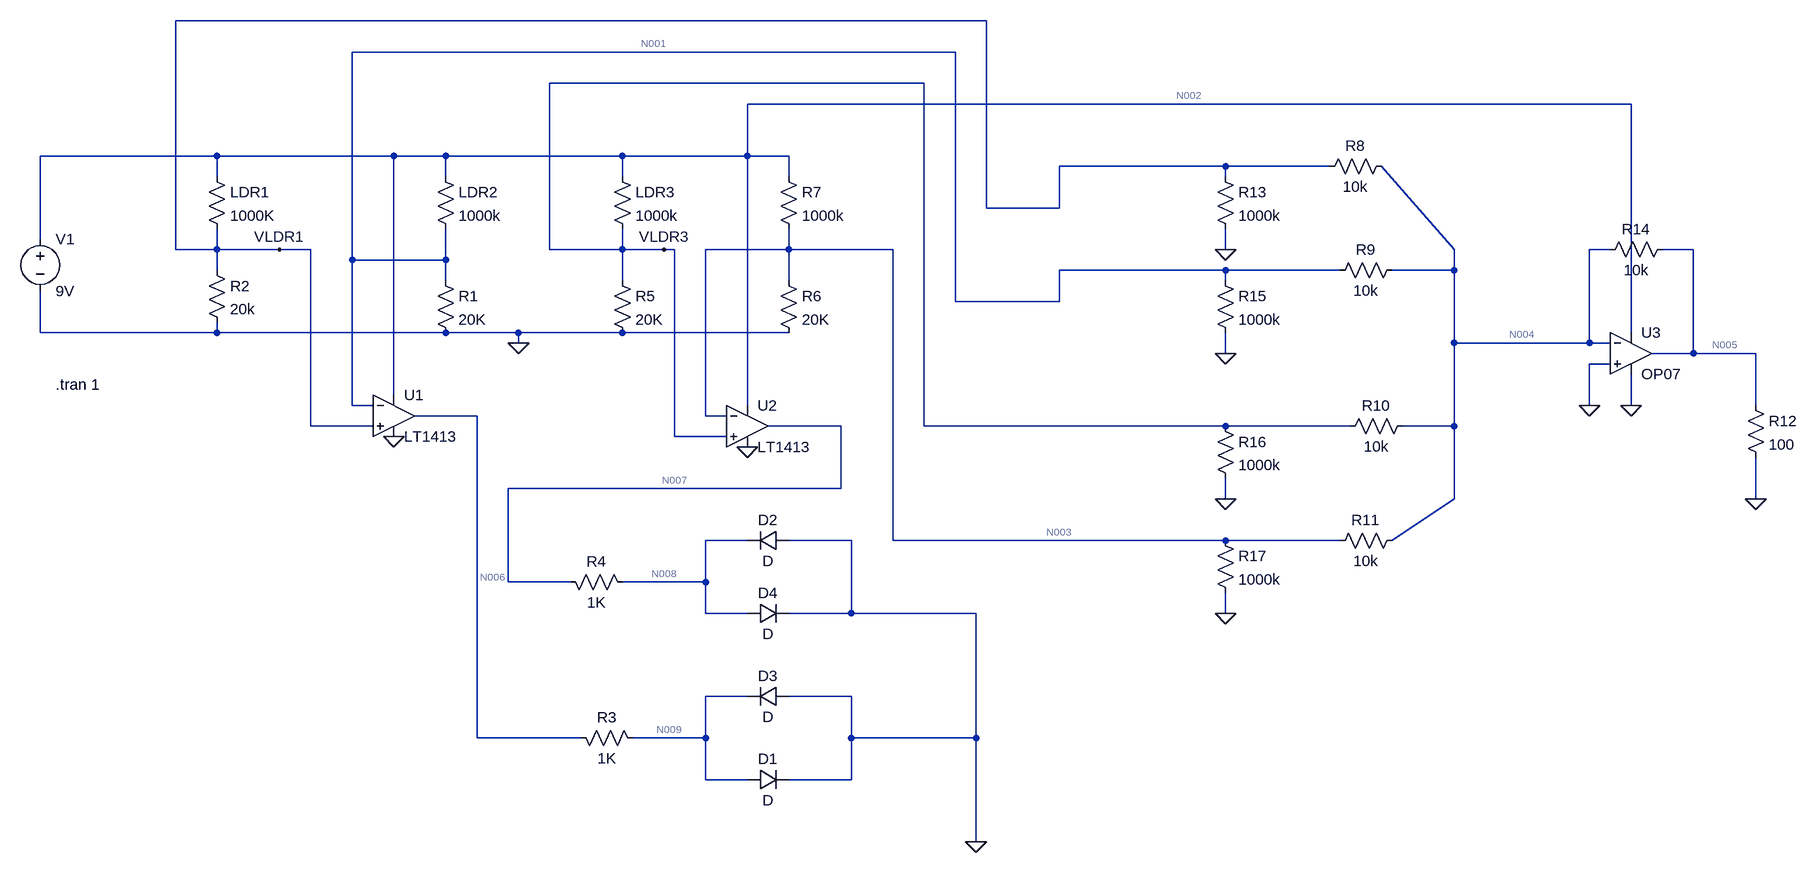
[diagram p0: schematic Draft4.asc]
Draft4.asc, the LTspice schematic file:
Version 4.1
SHEET 1 2868 1060
WIRE 1504 -224 256 -224
WIRE 1456 -176 528 -176
WIRE 1408 -128 832 -128
WIRE 2496 -96 1136 -96
WIRE 320 -16 48 -16
WIRE 592 -16 320 -16
WIRE 672 -16 592 -16
WIRE 944 -16 672 -16
WIRE 1136 -16 1136 -96
WIRE 1136 -16 944 -16
WIRE 1200 -16 1136 -16
WIRE 1872 0 1616 0
WIRE 2032 0 1872 0
WIRE 320 16 320 -16
WIRE 672 16 672 -16
WIRE 944 16 944 -16
WIRE 1200 16 1200 -16
WIRE 1872 16 1872 0
WIRE 1504 64 1504 -224
WIRE 1616 64 1616 0
WIRE 1616 64 1504 64
WIRE 48 112 48 -16
WIRE 256 128 256 -224
WIRE 320 128 320 96
WIRE 320 128 256 128
WIRE 416 128 320 128
WIRE 464 128 416 128
WIRE 832 128 832 -128
WIRE 944 128 944 96
WIRE 944 128 832 128
WIRE 1008 128 944 128
WIRE 1024 128 1008 128
WIRE 1200 128 1200 96
WIRE 1200 128 1072 128
WIRE 1360 128 1200 128
WIRE 1872 128 1872 96
WIRE 2224 128 2112 0
WIRE 2464 128 2432 128
WIRE 2592 128 2544 128
WIRE 528 144 528 -176
WIRE 672 144 672 96
WIRE 672 144 528 144
WIRE 320 160 320 128
WIRE 1872 160 1616 160
WIRE 2048 160 1872 160
WIRE 2224 160 2224 128
WIRE 2224 160 2128 160
WIRE 672 176 672 144
WIRE 944 176 944 128
WIRE 1200 176 1200 128
WIRE 1872 176 1872 160
WIRE 1456 208 1456 -176
WIRE 1616 208 1616 160
WIRE 1616 208 1456 208
WIRE 48 256 48 192
WIRE 320 256 320 240
WIRE 320 256 48 256
WIRE 672 256 320 256
WIRE 784 256 672 256
WIRE 944 256 784 256
WIRE 1200 256 944 256
WIRE 2496 256 2496 -96
WIRE 784 272 784 256
WIRE 2224 272 2224 160
WIRE 2432 272 2432 128
WIRE 2432 272 2224 272
WIRE 2464 272 2432 272
WIRE 1872 288 1872 256
WIRE 2592 288 2592 128
WIRE 2592 288 2528 288
WIRE 2688 288 2592 288
WIRE 2464 304 2432 304
WIRE 592 352 592 -16
WIRE 528 368 528 144
WIRE 560 368 528 368
WIRE 1136 368 1136 -16
WIRE 2432 368 2432 304
WIRE 2496 368 2496 320
WIRE 2688 368 2688 288
WIRE 720 384 624 384
WIRE 1072 384 1072 128
WIRE 1104 384 1072 384
WIRE 464 400 464 128
WIRE 560 400 464 400
WIRE 1280 400 1168 400
WIRE 1408 400 1408 -128
WIRE 1872 400 1408 400
WIRE 2064 400 1872 400
WIRE 2224 400 2224 272
WIRE 2224 400 2144 400
WIRE 1024 416 1024 128
WIRE 1104 416 1024 416
WIRE 1280 496 1280 400
WIRE 1280 496 768 496
WIRE 1872 512 1872 480
WIRE 2224 512 2224 400
WIRE 2688 512 2688 448
WIRE 1136 576 1072 576
WIRE 1296 576 1200 576
WIRE 1360 576 1360 128
WIRE 1872 576 1360 576
WIRE 2048 576 1872 576
WIRE 2128 576 2224 512
WIRE 768 640 768 496
WIRE 864 640 768 640
WIRE 1072 640 1072 576
WIRE 1072 640 944 640
WIRE 1072 688 1072 640
WIRE 1136 688 1072 688
WIRE 1296 688 1296 576
WIRE 1296 688 1200 688
WIRE 1488 688 1296 688
WIRE 1872 688 1872 656
WIRE 1136 816 1072 816
WIRE 1296 816 1200 816
WIRE 720 880 720 384
WIRE 880 880 720 880
WIRE 1072 880 1072 816
WIRE 1072 880 960 880
WIRE 1296 880 1296 816
WIRE 1488 880 1488 688
WIRE 1488 880 1296 880
WIRE 1072 944 1072 880
WIRE 1136 944 1072 944
WIRE 1296 944 1296 880
WIRE 1296 944 1200 944
WIRE 1488 1040 1488 880
FLAG 592 416 0
FLAG 1136 432 0
FLAG 784 272 0
FLAG 416 128 VLDR1
FLAG 1008 128 VLDR3
FLAG 1488 1040 0
FLAG 2496 368 0
FLAG 2688 512 0
FLAG 2432 368 0
FLAG 1872 128 0
FLAG 1872 288 0
FLAG 1872 512 0
FLAG 1872 688 0
DATAFLAG 1184 256 ""
SYMBOL voltage 48 96 R0
WINDOW 123 0 0 Left 0
WINDOW 39 0 0 Left 0
SYMATTR InstName V1
SYMATTR Value 9V
SYMBOL res 304 0 R0
SYMATTR InstName LDR1
SYMATTR Value 1000K
SYMBOL res 304 144 R0
SYMATTR InstName R2
SYMATTR Value 20k
SYMBOL res 656 160 R0
SYMATTR InstName R1
SYMATTR Value 20K
SYMBOL res 656 0 R0
SYMATTR InstName LDR2
SYMATTR Value 1000k
SYMBOL res 928 0 R0
SYMATTR InstName LDR3
SYMATTR Value 1000k
SYMBOL res 928 160 R0
SYMATTR InstName R5
SYMATTR Value 20K
SYMBOL res 1184 160 R0
SYMATTR InstName R6
SYMATTR Value 20K
SYMBOL res 1184 0 R0
SYMATTR InstName R7
SYMATTR Value 1000k
SYMBOL OpAmps\\LT1413 592 320 R0
SYMATTR InstName U1
SYMBOL OpAmps\\LT1413 1136 336 R0
SYMATTR InstName U2
SYMBOL res 976 896 M270
WINDOW 0 32 56 VTop 2
WINDOW 3 0 56 VBottom 2
SYMATTR InstName R3
SYMATTR Value 1K
SYMBOL res 960 656 M270
WINDOW 0 32 56 VTop 2
WINDOW 3 0 56 VBottom 2
SYMATTR InstName R4
SYMATTR Value 1K
SYMBOL diode 1136 960 R270
WINDOW 0 32 32 VTop 2
WINDOW 3 0 32 VBottom 2
SYMATTR InstName D1
SYMBOL diode 1200 560 R90
WINDOW 0 0 32 VBottom 2
WINDOW 3 32 32 VTop 2
SYMATTR InstName D2
SYMBOL diode 1200 800 R90
WINDOW 0 0 32 VBottom 2
WINDOW 3 32 32 VTop 2
SYMATTR InstName D3
SYMBOL diode 1136 704 R270
WINDOW 0 32 32 VTop 2
WINDOW 3 0 32 VBottom 2
SYMATTR InstName D4
SYMBOL res 2128 -16 R90
WINDOW 0 0 56 VBottom 2
WINDOW 3 32 56 VTop 2
SYMATTR InstName R8
SYMATTR Value 10k
SYMBOL res 2144 144 R90
WINDOW 0 0 56 VBottom 2
WINDOW 3 32 56 VTop 2
SYMATTR InstName R9
SYMATTR Value 10k
SYMBOL res 2160 384 R90
WINDOW 0 0 56 VBottom 2
WINDOW 3 32 56 VTop 2
SYMATTR InstName R10
SYMATTR Value 10k
SYMBOL res 2144 560 R90
WINDOW 0 0 56 VBottom 2
WINDOW 3 32 56 VTop 2
SYMATTR InstName R11
SYMATTR Value 10k
SYMBOL OpAmps\\OP07 2496 224 R0
SYMATTR InstName U3
SYMBOL res 2560 112 R90
WINDOW 0 0 56 VBottom 2
WINDOW 3 32 56 VTop 2
SYMATTR InstName R14
SYMATTR Value 10k
SYMBOL res 2672 352 R0
SYMATTR InstName R12
SYMATTR Value 100
SYMBOL res 1856 0 R0
SYMATTR InstName R13
SYMATTR Value 1000k
SYMBOL res 1856 160 R0
SYMATTR InstName R15
SYMATTR Value 1000k
SYMBOL res 1856 384 R0
SYMATTR InstName R16
SYMATTR Value 1000k
SYMBOL res 1856 560 R0
SYMATTR InstName R17
SYMATTR Value 1000k
TEXT 72 336 Left 2 !.tran 1

The netlist it stands for:
* Draft4.asc
V1 N002 0 9V
R§LDR1 N002 VLDR1 1000K
R2 VLDR1 0 20k
R1 N001 0 20K
R§LDR2 N002 N001 1000k
R§LDR3 N002 VLDR3 1000k
R5 VLDR3 0 20K
R6 N003 0 20K
R7 N002 N003 1000k
X§U1 VLDR1 N001 N002 0 N006 LT1413  ; pins In+ In- V+ V- OUT
X§U2 VLDR3 N003 N002 0 N007 LT1413  ; pins In+ In- V+ V- OUT
R3 N009 N006 1K
R4 N008 N007 1K
D1 N009 0 D
D2 0 N008 D
D3 0 N009 D
D4 N008 0 D
R8 N004 VLDR1 10k
R9 N004 N001 10k
R10 N004 VLDR3 10k
R11 N004 N003 10k
X§U3 0 N004 N002 0 N005 LT1001  ; OP07, pins In+ In- V+ V- OUT
R14 N005 N004 10k
R12 N005 0 100
R13 VLDR1 0 1000k
R15 N001 0 1000k
R16 VLDR3 0 1000k
R17 N003 0 1000k
.model D D
.lib standard.dio
.tran 1
.lib LTC.lib
.backanno
.end

* Results of the author's LTspice run, read from the files saved beside the schematic
* Operating Point, zero values left out:
*   V(vldr1) = 316.7 mV
*   V(vldr3) = 316.7 mV
*   V(n003) = 316.7 mV
*   V(n007) = 4.075 V
*   V(n004) = 391.3 mV
*   V(n002) = 9 V
*   V(n001) = 316.7 mV
*   V(n006) = 4.075 V
*   V(n009) = 686.7 mV
*   V(n008) = 686.7 mV
*   V(n005) = 689.7 mV
*   I(V1) = -13.86 mA
*   I(R2) = 15.84 µA
*   I(LDR2) = 8.683 µA
*   I(LDR3) = 8.683 µA
*   I(R6) = 15.84 µA
*   I(R4) = -3.388 mA
*   I(R8) = 7.458 µA
*   I(R9) = 7.458 µA
*   I(R11) = 7.458 µA
*   I(R14) = 29.84 µA
*   I(R13) = 316.7 nA
*   I(R15) = 316.7 nA
*   I(R17) = 316.7 nA
*   I(R5) = 15.84 µA
*   I(R7) = 8.683 µA
*   I(R3) = -3.388 mA
*   I(D4) = 3.388 mA
*   I(R10) = 7.458 µA
*   I(LDR1) = 8.683 µA
*   I(R1) = 15.84 µA
*   I(D1) = 3.388 mA
*   I(R12) = 6.897 mA
*   I(R16) = 316.7 nA
*   Ix(u2:1) = -12.42 nA
*   Ix(u2:2) = -12.42 nA
*   Ix(u2:3) = 3.388 mA
*   Ix(u2:4) = -78.62 pA
*   Ix(u2:5) = -3.388 mA
*   Ix(u1:1) = -12.42 nA
*   Ix(u1:2) = -12.42 nA
*   Ix(u1:3) = 3.388 mA
*   Ix(u1:4) = -78.62 pA
*   Ix(u1:5) = -3.388 mA
*   Ix(u3:1) = -5.291 nA
*   Ix(u3:2) = 5.275 nA
*   Ix(u3:3) = 7.048 mA
*   Ix(u3:4) = -119.2 µA
*   Ix(u3:5) = -6.927 mA